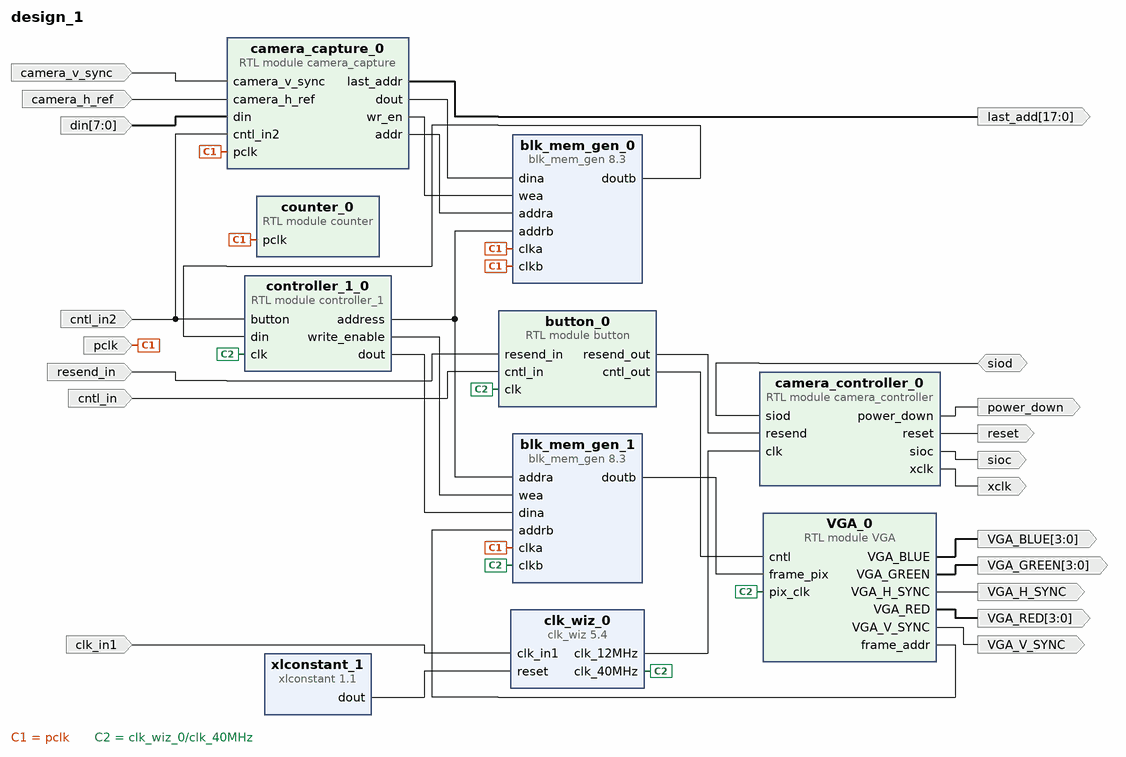
[diagram p0: block diagram of the top level]
# Vivado block design design_1, xc7a100tcsg324-1, Vivado 2017.2
create_bd_design design_1

create_bd_port -dir O VGA_H_SYNC
create_bd_port -dir O VGA_V_SYNC
create_bd_port -dir O -from 3 -to 0 VGA_RED
create_bd_port -dir O -from 3 -to 0 VGA_BLUE
create_bd_port -dir O -from 3 -to 0 VGA_GREEN
create_bd_port -dir I -type clk clk_in1
create_bd_port -dir O power_down
create_bd_port -dir O -type rst reset
create_bd_port -dir O sioc
create_bd_port -dir IO siod
create_bd_port -dir O xclk
create_bd_port -dir I resend_in
create_bd_port -dir I cntl_in
create_bd_port -dir I cntl_in2
create_bd_port -dir O -from 17 -to 0 -type data last_add
create_bd_port -dir I pclk
create_bd_port -dir I camera_v_sync
create_bd_port -dir I camera_h_ref
create_bd_port -dir I -from 7 -to 0 din

create_bd_cell -type ip -vlnv xilinx.com:ip:clk_wiz:5.4 clk_wiz_0
set_property -dict [list \
  CONFIG.CLKOUT2_USED true \
  CONFIG.CLKOUT3_USED true \
  CONFIG.CLKOUT4_USED true \
  CONFIG.NUM_OUT_CLKS 4 \
  CONFIG.CLK_OUT1_PORT clk_vga_148_5MHz \
  CONFIG.CLK_OUT2_PORT clk_40MHz \
  CONFIG.CLK_OUT3_PORT clk_12MHz \
  CONFIG.CLK_OUT4_PORT test_24MHz \
  CONFIG.CLKOUT1_REQUESTED_OUT_FREQ 148.500 \
  CONFIG.CLKOUT2_REQUESTED_OUT_FREQ 40 \
  CONFIG.CLKOUT3_REQUESTED_OUT_FREQ 12 \
  CONFIG.CLKOUT4_REQUESTED_OUT_FREQ 24 \
  CONFIG.MMCM_DIVCLK_DIVIDE 1 \
  CONFIG.MMCM_CLKFBOUT_MULT_F 11.875 \
  CONFIG.MMCM_CLKOUT0_DIVIDE_F 8.000 \
  CONFIG.MMCM_CLKOUT1_DIVIDE 30 \
  CONFIG.MMCM_CLKOUT2_DIVIDE 99 \
  CONFIG.MMCM_CLKOUT3_DIVIDE 50 \
  CONFIG.CLKOUT1_JITTER 108.254 \
  CONFIG.CLKOUT1_PHASE_ERROR 87.466 \
  CONFIG.CLKOUT2_JITTER 140.599 \
  CONFIG.CLKOUT2_PHASE_ERROR 87.466 \
  CONFIG.CLKOUT3_JITTER 182.550 \
  CONFIG.CLKOUT3_PHASE_ERROR 87.466 \
  CONFIG.CLKOUT4_JITTER 157.650 \
  CONFIG.CLKOUT4_PHASE_ERROR 87.466 \
] [get_bd_cells clk_wiz_0]
create_bd_cell -type ip -vlnv xilinx.com:ip:blk_mem_gen:8.3 blk_mem_gen_0
set_property -dict [list \
  CONFIG.Memory_Type Simple_Dual_Port_RAM \
  CONFIG.Enable_32bit_Address false \
  CONFIG.Use_Byte_Write_Enable false \
  CONFIG.Write_Width_A 12 \
  CONFIG.Write_Depth_A 19200 \
  CONFIG.Operating_Mode_A WRITE_FIRST \
  CONFIG.Enable_A Always_Enabled \
  CONFIG.Write_Width_B 12 \
  CONFIG.Read_Width_B 12 \
  CONFIG.Enable_B Always_Enabled \
  CONFIG.Register_PortB_Output_of_Memory_Primitives false \
  CONFIG.Load_Init_File false \
  CONFIG.Fill_Remaining_Memory_Locations true \
  CONFIG.Remaining_Memory_Locations 0 \
  CONFIG.Port_B_Clock 100 \
  CONFIG.Port_B_Enable_Rate 100 \
  CONFIG.Disable_Collision_Warnings false \
  CONFIG.use_bram_block Stand_Alone \
] [get_bd_cells blk_mem_gen_0]
create_bd_cell -type ip -vlnv xilinx.com:ip:xlconstant:1.1 xlconstant_1
set_property -dict {CONFIG.CONST_VAL 0} [get_bd_cells xlconstant_1]
create_bd_cell -type module -reference counter counter_0
create_bd_cell -type module -reference button button_0
create_bd_cell -type module -reference camera_controller camera_controller_0
create_bd_cell -type module -reference camera_capture camera_capture_0
create_bd_cell -type module -reference VGA VGA_0
create_bd_cell -type ip -vlnv xilinx.com:ip:blk_mem_gen:8.3 blk_mem_gen_1
set_property -dict [list \
  CONFIG.Memory_Type Simple_Dual_Port_RAM \
  CONFIG.Enable_32bit_Address false \
  CONFIG.Use_Byte_Write_Enable false \
  CONFIG.Write_Width_A 12 \
  CONFIG.Write_Depth_A 19200 \
  CONFIG.Operating_Mode_A NO_CHANGE \
  CONFIG.Enable_A Always_Enabled \
  CONFIG.Write_Width_B 12 \
  CONFIG.Read_Width_B 12 \
  CONFIG.Enable_B Always_Enabled \
  CONFIG.Register_PortB_Output_of_Memory_Primitives false \
  CONFIG.Fill_Remaining_Memory_Locations false \
  CONFIG.Use_RSTB_Pin false \
  CONFIG.Port_A_Write_Rate 50 \
  CONFIG.Port_B_Clock 100 \
  CONFIG.Port_B_Enable_Rate 100 \
  CONFIG.use_bram_block Stand_Alone \
] [get_bd_cells blk_mem_gen_1]
create_bd_cell -type module -reference controller_1 controller_1_0

# ---- connections ----

connect_bd_net [get_bd_pins VGA_0/VGA_H_SYNC] [get_bd_ports VGA_H_SYNC]
connect_bd_net [get_bd_pins VGA_0/VGA_V_SYNC] [get_bd_ports VGA_V_SYNC]
connect_bd_net [get_bd_pins VGA_0/VGA_RED] [get_bd_ports VGA_RED]
connect_bd_net [get_bd_pins VGA_0/VGA_BLUE] [get_bd_ports VGA_BLUE]
connect_bd_net [get_bd_pins VGA_0/VGA_GREEN] [get_bd_ports VGA_GREEN]
connect_bd_net -net clk_in1_1 [get_bd_ports clk_in1] [get_bd_pins clk_wiz_0/clk_in1]
connect_bd_net [get_bd_pins camera_capture_0/dout] [get_bd_pins blk_mem_gen_0/dina]
connect_bd_net [get_bd_pins camera_controller_0/power_down] [get_bd_ports power_down]
connect_bd_net [get_bd_pins camera_controller_0/reset] [get_bd_ports reset]
connect_bd_net [get_bd_pins camera_controller_0/sioc] [get_bd_ports sioc]
connect_bd_net [get_bd_ports siod] [get_bd_pins camera_controller_0/siod]
connect_bd_net [get_bd_pins camera_controller_0/xclk] [get_bd_ports xclk]
connect_bd_net [get_bd_pins xlconstant_1/dout] [get_bd_pins clk_wiz_0/reset]
connect_bd_net [get_bd_ports resend_in] [get_bd_pins button_0/resend_in]
connect_bd_net [get_bd_pins button_0/resend_out] [get_bd_pins camera_controller_0/resend]
connect_bd_net [get_bd_ports cntl_in] [get_bd_pins button_0/cntl_in]
connect_bd_net [get_bd_pins camera_capture_0/wr_en] [get_bd_pins blk_mem_gen_0/wea]
connect_bd_net -net cntl_in2_1 [get_bd_ports cntl_in2] [get_bd_pins camera_capture_0/cntl_in2] [get_bd_pins controller_1_0/button]
connect_bd_net [get_bd_pins camera_capture_0/last_addr] [get_bd_ports last_add]
connect_bd_net [get_bd_pins clk_wiz_0/clk_12MHz] [get_bd_pins camera_controller_0/clk]
connect_bd_net [get_bd_pins button_0/cntl_out] [get_bd_pins VGA_0/cntl]
connect_bd_net [get_bd_ports pclk] \
  [get_bd_pins blk_mem_gen_0/clka] [get_bd_pins counter_0/pclk] [get_bd_pins camera_capture_0/pclk] \
  [get_bd_pins blk_mem_gen_1/clka] [get_bd_pins blk_mem_gen_0/clkb]
connect_bd_net [get_bd_ports camera_v_sync] [get_bd_pins camera_capture_0/camera_v_sync]
connect_bd_net [get_bd_ports camera_h_ref] [get_bd_pins camera_capture_0/camera_h_ref]
connect_bd_net [get_bd_ports din] [get_bd_pins camera_capture_0/din]
connect_bd_net [get_bd_pins VGA_0/frame_addr] [get_bd_pins blk_mem_gen_1/addrb]
connect_bd_net [get_bd_pins clk_wiz_0/clk_40MHz] \
  [get_bd_pins button_0/clk] [get_bd_pins VGA_0/pix_clk] [get_bd_pins blk_mem_gen_1/clkb] [get_bd_pins controller_1_0/clk]
connect_bd_net [get_bd_pins blk_mem_gen_1/doutb] [get_bd_pins VGA_0/frame_pix]
connect_bd_net [get_bd_pins blk_mem_gen_0/doutb] [get_bd_pins controller_1_0/din]
connect_bd_net [get_bd_pins controller_1_0/write_enable] [get_bd_pins blk_mem_gen_1/wea]
connect_bd_net [get_bd_pins controller_1_0/address] [get_bd_pins blk_mem_gen_1/addra] [get_bd_pins blk_mem_gen_0/addrb]
connect_bd_net [get_bd_pins controller_1_0/dout] [get_bd_pins blk_mem_gen_1/dina]
connect_bd_net [get_bd_pins camera_capture_0/addr] [get_bd_pins blk_mem_gen_0/addra]

validate_bd_design
save_bd_design
